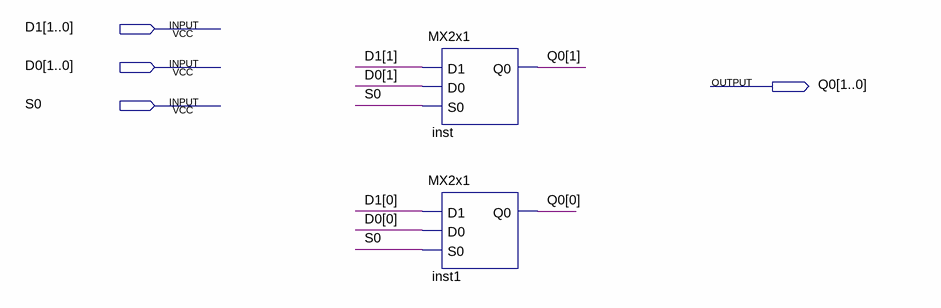
[diagram p0: schematic sheet]
// Quartus schematic MX2x2.bdf as structural Verilog: 2 symbols, 4 pins
module MX2x2 (
  input  [1:0] D1,
  input  [1:0] D0,
  input  S0,
  output [1:0] Q0
);

  MX2x1 inst (.D1(D1[1]), .D0(D0[1]), .S0(S0), .Q0(Q0[1]));
  MX2x1 inst1 (.D1(D1[0]), .D0(D0[0]), .S0(S0), .Q0(Q0[0]));
endmodule
